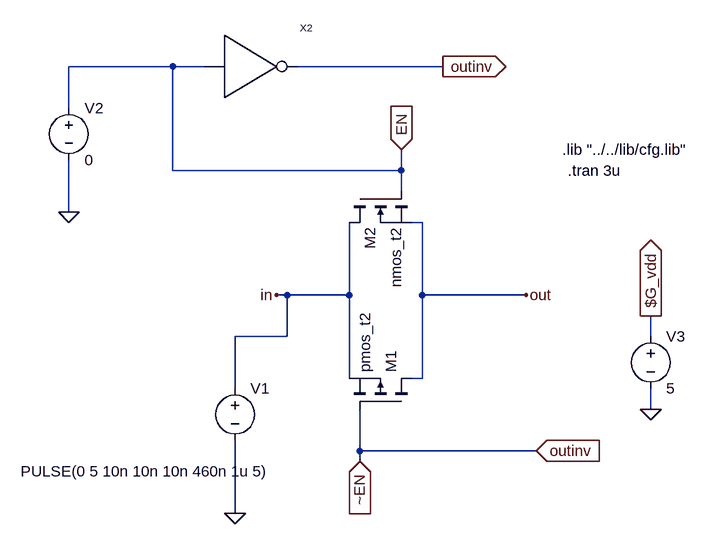
[diagram p0: schematic test_transmition_gate.asc]
test_transmition_gate.asc, the LTspice schematic file:
Version 4
SHEET 1 1532 680
WIRE -192 -176 -352 -176
WIRE -144 -176 -192 -176
WIRE 224 -176 0 -176
WIRE -352 -112 -352 -176
WIRE -192 -16 -192 -176
WIRE 160 -16 160 -48
WIRE 160 -16 -192 -16
WIRE 160 16 160 -16
WIRE -352 48 -352 -32
WIRE 192 64 176 64
WIRE -16 176 -32 176
WIRE 80 176 80 64
WIRE 80 176 -16 176
WIRE 192 176 192 64
WIRE 352 176 192 176
WIRE -16 240 -16 176
WIRE -16 240 -96 240
WIRE 544 240 544 208
WIRE 80 304 80 176
WIRE 192 304 192 176
WIRE 192 304 176 304
WIRE -96 320 -96 240
WIRE 544 352 544 320
WIRE 96 416 96 352
WIRE 368 416 96 416
WIRE 96 432 96 416
WIRE -96 512 -96 400
FLAG 352 176 out
FLAG -32 176 in
FLAG 160 -48 EN
IOPIN 160 -48 In
FLAG 96 432 ~EN
IOPIN 96 432 In
FLAG -96 512 0
FLAG -352 48 0
FLAG 544 208 $G_vdd
IOPIN 544 208 Out
FLAG 544 352 0
FLAG 224 -176 outinv
IOPIN 224 -176 Out
FLAG 368 416 outinv
IOPIN 368 416 In
SYMBOL pmos 176 352 M270
SYMATTR InstName M1
SYMATTR Value pmos_t2
SYMATTR Prefix X
SYMBOL nmos 80 16 M90
SYMATTR InstName M2
SYMATTR Value nmos_t2
SYMATTR Prefix X
SYMBOL voltage -96 304 R0
WINDOW 3 -330 143 Left 2
WINDOW 123 0 0 Left 0
WINDOW 39 0 0 Left 0
SYMATTR Value PULSE(0 5 10n 10n 10n 460n 1u 5)
SYMATTR InstName V1
SYMBOL voltage -352 -128 R0
WINDOW 123 0 0 Left 0
WINDOW 39 0 0 Left 0
SYMATTR InstName V2
SYMATTR Value 0
SYMBOL inverter -112 -176 R0
SYMATTR InstName X2
SYMBOL voltage 544 224 R0
SYMATTR InstName V3
SYMATTR Value 5
TEXT 408 -48 Left 2 !.lib "../../lib/cfg.lib"
TEXT 416 -16 Left 2 !.tran 3u

The netlist it stands for:
* test_transmition_gate.asc
XM1 out outinv in pmos_t2  ; pins D G S
XM2 in EN out nmos_t2  ; pins D G S
V1 in 0 PULSE(0 5 10n 10n 10n 460n 1u 5)
V2 EN 0 0
XX2 EN outinv inverter  ; pins Vin Vout
V3 $G_vdd 0 5
.lib "../../lib/cfg.lib"
.tran 3u
.backanno
.end